# Altium schematic sheet 1_Main copy.schdoc
size 497 x 243 mm; Name: A_A4; Symbol: A_A4; Device: A_A4; @Project Name: TUD-EnergyHarvestingConsole_2022-08-29_17-01-09; REV: 1.0; Date: 2022-08-11; Sheet: 1/1; Draw By: Alejandro Cabrerizo; Convert to PCB: yes; Add into BOM: yes
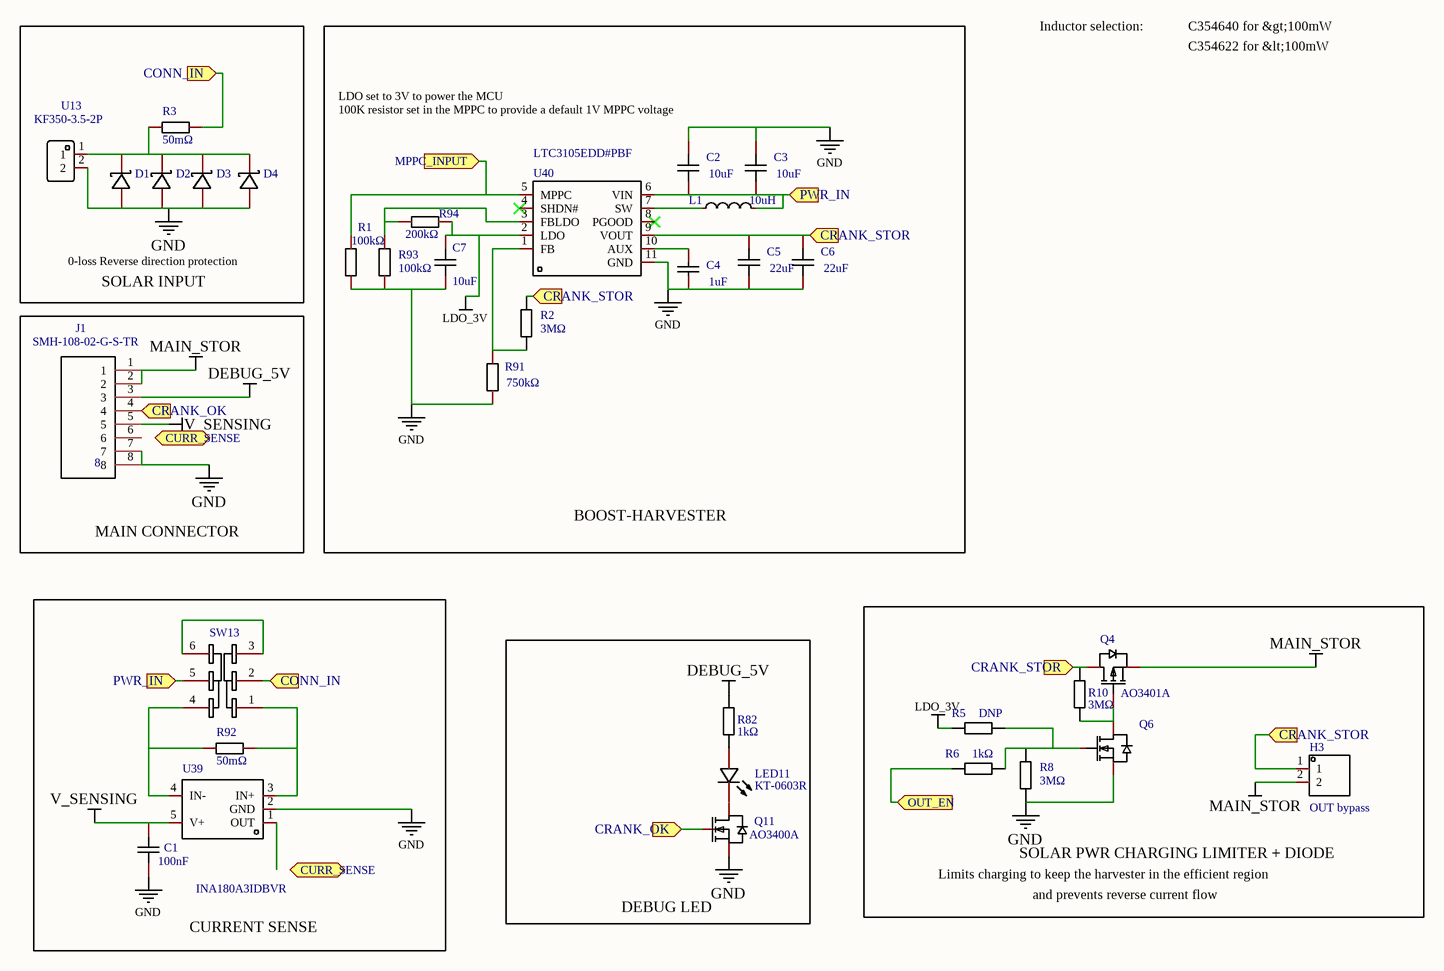
[diagram p0: 1_Main copy.schdoc]

## Parts
C1  100nF  [C0603]
C2  10uF  [C0603]
C3  10uF  [C0603]
C4  1uF  [C0603]
C5  22uF  [C0805]
C6  value 22uF  [C0805]  (hidden comment: CL21A226MAQNNNE_C45783)
C7  10uF  [C0603]
D1  SS54  [SMA_L4.4-W2.8-LS5.4-R-RD]  (value not drawn)
D2  SS54  [SMA_L4.4-W2.8-LS5.4-R-RD]  (value not drawn)
D3  SS54  [SMA_L4.4-W2.8-LS5.4-R-RD]  (value not drawn)
D4  SS54  [SMA_L4.4-W2.8-LS5.4-R-RD]  (value not drawn)
H3  OUT bypass  [HDR-TH_2P-P2.54-V-M-1]
J1  NAME: 8  [SMH-108-02-XX-S-TR]  (hidden comment: SMH-108-02-G-S-TR)
L1  value 10uH  [IND-SMD_L6.0-W6.0]  (hidden comment: CKCS6028-10uH/M)
LED11  KT-0603R  [LED0603-R-RD]
Q4  AO3401A  [SOT-23_L2.9-W1.3-P1.90-LS2.4-BR]
Q6  SI2302  [SOT-23-3_L2.9-W1.3-P1.90-LS2.4-BR]  (value not drawn)
Q11  AO3400A  [SOT-23-3_L2.9-W1.3-P1.90-LS2.4-BR]
R1  100kΩ  [R0603]
R2  3MΩ  [R0603]
R3  value 50mΩ  [R1206]  (hidden comment: 1206W3F500MT5E_C127691)
R5  DNP  [R0603]
R6  1kΩ  [R0603]
R8  3MΩ  [R0603]
R10  3MΩ  [R0603]
R82  1kΩ  [R0603]
R91  750kΩ  [R0603]
R92  value 50mΩ  [R1206]  (hidden comment: 1206W3F500MT5E_C127691)
R93  100kΩ  [R0603]
R94  value 200kΩ  [R0603]  (hidden comment: 0603WAF2003T5E)
SW13  K3-2235D-F1  [SW-TH_K3-2235D-F1]  (value not drawn)
U13  KF350-3.5-2P  [CONN-TH_P3.50_KF350-3.5-2P]
U39  INA180A3IDBVR  [SOT-23-5_L3.0-W1.7-P0.95-LS2.8-BR]
U40  LTC3105EDD#PBF  [DFN-10_L3.0-W3.0-P0.50-BL-EP_LTC3105EDD]

## Blocks framed on the sheet
SOLAR INPUT: D1-D4 R3 U13
BOOST-HARVESTER: C2-C7 L1 R1 R2 R91 R93 R94 U40
MAIN CONNECTOR: J1
CURRENT SENSE: C1 R92 SW13 U39
DEBUG LED: LED11 Q11 R82
SOLAR PWR CHARGING LIMITER + DIODE: H3 Q4 Q6 R5 R6 R8 R10

## Ports
CONN_IN (in), CRANK_OK (in), CRANK_STOR (in), CURR_SENSE (bidir), MPPC_INPUT (in), OUT_EN (in), PWR_IN (in)

## Nets
DEBUG_5V: J1.3 R82.2
GND: C1.1 C2.2 C3.2 C4.1 C5.1 C6.1 C7.1 D1.1(A) D2.1(A) D3.1(A) D4.1(A) J1.7 J1.8 Q6.2(S) Q11.2(S) R1.1 R8.2 R91.1 R93.1 U13.2 U39.2(GND) U40.11(GND)
LDO_3V: C7.2 R5.2 R94.2 U40.2(LDO)
MAIN_STOR: H3.2 J1.1 J1.2 Q4.2(S)
V_SENSING: C1.2 J1.5 U39.5(V+)
CONN_IN: R3.2 SW13.2 ; port CONN_IN
CRANK_OK: J1.4 Q11.1(G) ; port CRANK_OK
CRANK_STOR: C5.2 C6.2 H3.1 Q4.3(D) R2.1 R10.2 U40.9(VOUT) ; port CRANK_STOR
MPPC_INPUT: R1.2 U40.5(MPPC) ; port MPPC_INPUT
OUT_EN: R6.2 ; port OUT_EN
PWR_IN: C2.1 C3.1 L1.2 SW13.5 U40.6(VIN) ; port PWR_IN
NetC4_2: C4.2 U40.10(AUX)
NetD1_2: D1.2(K) D2.2(K) D3.2(K) D4.2(K) R3.1 U13.1
NetL1_1: L1.1 U40.7(SW)
NetLED11_1: LED11.1(A) R82.1
NetLED11_2: LED11.2(K) Q11.3(D)
NetQ4_1: Q4.1(G) Q6.3(D) R10.1
NetQ6_1: Q6.1(G) R5.1 R6.1 R8.1
NetR2_2: R2.2 R91.2 U40.1(FB)
NetR92_1: R92.1 SW13.4 U39.4(IN-)
NetR92_2: R92.2 SW13.1 U39.3(IN+)
NetR93_2: R93.2 R94.1 U40.3(FBLDO)
NetSW13_3: SW13.3 SW13.6

Not connected (* = marked no-connect by the designer): J1 6; U39 1(OUT); U40 4(SHDN#)* 8(PGOOD)*

## Notes on the sheet
- Inductor selection:
- C354622 for &lt;100mW
- C354640 for &gt;100mW
- (near R94) LDO set to 3V to power the MCU
  100K resistor set in the MPPC to provide a default 1V MPPC voltage
- 0-loss Reverse direction protection
- Limits charging to keep the harvester in the efficient region
- and prevents reverse current flow
- 1
- 2
- 3
- 4
- 5
- A
- B
- C
- D
- TITLE:
- TUD-EnergyHarvestingConsole_2022-08-29_17-01-09
- REV:
- 1.0
- Date:
- Company:
- 2022-08-11
- Drawn By:
- Alejandro Cabrerizo
- Sheet:
- 1/1

## Library data of the parts
C1 = CC0603KRX7R9BB104: Manufacturer: YAGEO; Convert to PCB: yes; NAME: 2; Name: 100nF; Symbol: 100nF; Device: CC0603KRX7R9BB104; Supplier: LCSC; Manufacturer Part: CC0603KRX7R9BB104; Supplier Part: C14663; JLCPCB Part Class: Basic; Add into BOM: yes; Origin Footprint: C0603; NUMBER: 2
C2 C3 C7 = CL10A106MA8NRNC: Capacitance: Tolerance:±20% Tolerance:±20% Voltage Rated: Temperature Coefficient:; Manufacturer: SAMSUNG(三星); Add into BOM: yes; Tolerance: ±20%; Name: 10uF; Symbol: CL10A106MA8NRNC; Device: CL10A106MA8NRNC; LCSC Part Name: 10uF ±20% 25V; Supplier Part: C96446; Manufacturer Part: CL10A106MA8NRNC; Supplier Footprint: 0603; JLCPCB Part Class: Basic Part; Datasheet: https://atta.szlcsc.com/upload/public/pdf/source/20170325/1490427913016.pdf; Supplier: LCSC; Convert to PCB: yes; Value: 10uF
C4 = CL10A105KB8NNNC: Capacitance: Tolerance:±10% Tolerance:±10% Voltage Rated: Temperature Coefficient:; Manufacturer: SAMSUNG(三星); Add into BOM: yes; Tolerance: ±10%; Name: 1uF; Symbol: CL10A105KB8NNNC; Device: CL10A105KB8NNNC; LCSC Part Name: 1uF ±10% 50V; Supplier Part: C15849; Manufacturer Part: CL10A105KB8NNNC; Supplier Footprint: 0603; JLCPCB Part Class: Basic Part; Datasheet: https://atta.szlcsc.com/upload/public/pdf/source/20160103/1457707679084.pdf; Supplier: LCSC; Convert to PCB: yes; Value: 1uF
C5 C6 = CL21A226MAQNNNE_C45783: Capacitance: Tolerance:±20% Tolerance:±20% Voltage Rated: Temperature Coefficient:; Manufacturer: SAMSUNG(三星); Add into BOM: yes; Tolerance: ±20%; Name: 22uF; Symbol: CL21A226MAQNNNE; Device: CL21A226MAQNNNE_C45783; LCSC Part Name: 22uF ±20% 25V; Supplier Part: C45783; Manufacturer Part: CL21A226MAQNNNE; Supplier Footprint: 0805; JLCPCB Part Class: Basic Part; Datasheet: https://atta.szlcsc.com/upload/public/pdf/source/20160103/1457707727161.pdf; Supplier: LCSC; Convert to PCB: yes
  C5: Value: 22uF
D1-D4 = SS54: Reverse Voltage (Vr):40V Average Rectified Current (Io):5A Forward Voltage (Vf@If):550mV@5A; Manufacturer: MDD; Symbol: SS54_C22452; Add into BOM: yes; Reverse Voltage (Vr): 40V; Average Rectified Current (Io): 5A; Device: SS54; LCSC Part Name: 40V 5A 550mV@5A; Supplier Part: C22452; Manufacturer Part: SS54; Supplier Footprint: SMA(DO-214AC); JLCPCB Part Class: Basic Part; Datasheet: https://atta.szlcsc.com/upload/public/pdf/source/20190306/C22452_DC5E4F74C3B638F6D8E4C7650D5BF30E.pdf; Supplier: LCSC; Convert to PCB: yes; Forward Voltage (Vf@If): 550mV@5A
H3 = HDR-M_2.54_1x2P: Symbol: 210S-1*2P L=11.6MMGold-plated black; Convert to PCB: yes; Name: OUT bypass; Device: HDR-M_2.54_1x2P; Add into BOM: yes; Supplier Footprint: Through
J1 = SMH-108-02-G-S-TR: Convert to PCB: yes; Name: SMH-108-02-G-S-TR; Symbol: SMH-108-02-G-S-TR; Device: SMH-108-02-G-S-TR; Add into BOM: yes; Origin Footprint: SMH-108-02-XX-S-TR
L1 = CKCS6028-10uH/M: Inductance: Tolerance: Tolerance: Rated Current: DC Resistance (DCR):; Manufacturer: CENKER(岑科); Add into BOM: yes; Name: 10uH; Symbol: CKCS6028-10UH/M; Device: CKCS6028-10uH/M; LCSC Part Name: 10uH ±20% 1.95A 72mΩ; Supplier Part: C354625; Manufacturer Part: CKCS6028-10uH/M; Supplier Footprint: SMD; JLCPCB Part Class: Extended Part; Datasheet: https://atta.szlcsc.com/upload/public/pdf/source/20190115/C354625_A8E6F49BBEB46DAB0D88928184334DFB.pdf; Supplier: LCSC; Convert to PCB: yes
LED11 = KT-0603R: Manufacturer: KENTO; Convert to PCB: yes; Name: KT-0603R; Symbol: KT-0603R; Device: KT-0603R; Supplier: LCSC; Manufacturer Part: KT-0603R; Supplier Part: C2286; JLCPCB Part Class: Basic Part; Add into BOM: yes; Origin Footprint: LED0603-R-RD
Q4 = AO3401A: Manufacturer: AOS; Convert to PCB: yes; Name: AO3401A; Symbol: AO3401A; Device: AO3401A; Supplier: LCSC; Manufacturer Part: AO3401A; Supplier Part: C15127; JLCPCB Part Class: Basic Part; Add into BOM: yes; Origin Footprint: SOT-23_L2.9-W1.3-P1.90-LS2.4-BR
Q6 = SI2302: Manufacturer: YONGYUTAI(永裕泰); Symbol: SI2302_C2891732; Add into BOM: yes; Device: SI2302; LCSC Part Name: SI2302; Supplier Part: C2891732; Manufacturer Part: SI2302; Supplier Footprint: SOT-23; JLCPCB Part Class: Extended Part; Datasheet: https://atta.szlcsc.com/upload/public/pdf/source/20210901/467BBA277A18343FF82D7D641AA41F7C.pdf; Supplier: LCSC; Convert to PCB: yes
Q11 = AO3400A: Manufacturer: HUASHUO(华朔); Convert to PCB: yes; Name: AO3400A; Symbol: AO3400A; Device: AO3400A; Supplier: LCSC; Supplier Part: C700953; Manufacturer Part: AO3400A; JLCPCB Part Class: Extended Part; Add into BOM: yes; Origin Footprint: SOT-23-3_L2.9-W1.3-P1.90-LS2.4-BR
R1 R93 = 0603WAF1003T5E: Type:Thick Film Resistors Resistance: Tolerance:±1% Tolerance:±1% Power(Watts): Temperature Coefficient:±100ppm/℃ Temperature Coefficient:±100ppm/℃ Overload Voltage (Max): Operating Temperature Range:-55℃~+155℃ Operating Temperature Range:-55℃~+155℃; Manufacturer: UNI-ROYAL(厚声); Add into BOM: yes; Tolerance: ±1%; Name: 100kΩ; Symbol: 0603WAF1003T5E; Device: 0603WAF1003T5E; LCSC Part Name: 100kΩ ±1% 100mW; Supplier Part: C25803; Manufacturer Part: 0603WAF1003T5E; Supplier Footprint: 0603; JLCPCB Part Class: Basic Part; Datasheet: https://atta.szlcsc.com/upload/public/pdf/source/20200306/C422600_1E6D84923E4A46A82E41ADD87F860B5C.pdf; Supplier: LCSC; Convert to PCB: yes; Type: Thick Film Resistors; Value: 100kΩ; Temperature Coefficient: ±100ppm/℃; Operating Temperature Range: -55℃~+155℃
R2 R8 R10 = 0603WAF3004T5E: Manufacturer: UniOhm; Resistance: 3M; Convert to PCB: yes; Name: 3MΩ; Symbol: 3MΩ; Device: 0603WAF3004T5E; Supplier: LCSC; Manufacturer Part: 0603WAF3004T5E; Supplier Part: C23156; JLCPCB Part Class: Basic Part; Add into BOM: yes; Origin Footprint: R0603
R3 R92 = 1206W3F500MT5E_C127691: Type:- Rated Current:- Rated Output Voltage:- Resistance: Tolerance:±1% Tolerance:±1% Power(Watts):- Temperature Coefficient:±800ppm/℃ Temperature Coefficient:±800ppm/℃ Mounting Sytle:; Manufacturer: UNI-ROYAL(厚声); Symbol: 1206W4F500MT5E; Add into BOM: yes; Tolerance: ±1%; Name: 50mΩ; Device: 1206W3F500MT5E_C127691; LCSC Part Name: 50mΩ ±1%; Supplier Part: C127691; Manufacturer Part: 1206W3F500MT5E; Supplier Footprint: 1206; JLCPCB Part Class: Extended Part; Datasheet: https://atta.szlcsc.com/upload/public/pdf/source/20170821/C127691_1503303435301901672.pdf; Supplier: LCSC; Convert to PCB: yes; Type: -; Rated Current: -; Rated Output Voltage: -; Power(Watts): -; Temperature Coefficient: ±800ppm/℃
R5 = 0603WAF1001T5E: Manufacturer: UniOhm; Symbol: 1kΩ; Resistance: 1K; Convert to PCB: yes; Name: DNP; Device: 0603WAF1001T5E; Supplier: LCSC; Manufacturer Part: 0603WAF1001T5E; Supplier Part: C21190; JLCPCB Part Class: Basic Part; Add into BOM: yes; Origin Footprint: R0603
R6 R82 = 0603WAF1001T5E: Manufacturer: UniOhm; Resistance: 1K; Convert to PCB: yes; Name: 1kΩ; Symbol: 1kΩ; Device: 0603WAF1001T5E; Supplier: LCSC; Manufacturer Part: 0603WAF1001T5E; Supplier Part: C21190; JLCPCB Part Class: Basic Part; Add into BOM: yes; Origin Footprint: R0603
R91 = 0603WAF7503T5E: Type:Thick Film Resistors Resistance: Tolerance:±1% Tolerance:±1% Power(Watts): Temperature Coefficient:±100ppm/℃ Temperature Coefficient:±100ppm/℃ Overload Voltage (Max): Operating Temperature Range:-55℃~+155℃ Operating Temperature Range:-55℃~+155℃; Manufacturer: UNI-ROYAL(厚声); Add into BOM: yes; Tolerance: ±1%; Name: 750kΩ; Symbol: 0603WAF7503T5E; Device: 0603WAF7503T5E; LCSC Part Name: 750kΩ ±1% 100mW; Supplier Part: C23240; Manufacturer Part: 0603WAF7503T5E; Supplier Footprint: 0603; JLCPCB Part Class: Basic Part; Datasheet: https://atta.szlcsc.com/upload/public/pdf/source/20200306/C422600_1E6D84923E4A46A82E41ADD87F860B5C.pdf; Supplier: LCSC; Convert to PCB: yes; Type: Thick Film Resistors; Value: 750kΩ; Temperature Coefficient: ±100ppm/℃; Operating Temperature Range: -55℃~+155℃
R94 = 0603WAF2003T5E: Resistance: Tolerance: Temperature Coefficient: Temperature Coefficient: Power(Watts): Overload Voltage (Max): Operating Temperature Range: Operating Temperature Range:; Manufacturer: UNI-ROYAL(厚声); Add into BOM: yes; Name: 200kΩ; Symbol: 0603WAF2003T5E; Device: 0603WAF2003T5E; LCSC Part Name: 200KΩ ±1%; Supplier Part: C25811; Manufacturer Part: 0603WAF2003T5E; Supplier Footprint: 0603; JLCPCB Part Class: Basic Part; Datasheet: https://atta.szlcsc.com/upload/public/pdf/source/20170920/C25811_1505901554531983383.pdf; Supplier: LCSC; Convert to PCB: yes
SW13 = K3-2235D-F1: Current Rating (DC):300mA Voltage Rating (DC):6V Current Rating (AC):- Voltage Rating (AC):- Circuit:双刀双掷 Mounting Style:直插 Mechanical Life:10000 Actuator Color:黑色 Actuator Style:矩形柱状 Pin Style:PC引脚 Operating Temperature:-25~+80 Operating Temperature:-2; Manufacturer: 韩国韩荣; Add into BOM: yes; Current Rating (DC): 300mA; Voltage Rating (DC): 6V; Circuit: 双刀双掷; Mechanical Life: 10000; Actuator Color: 黑色; Actuator Style: 矩形柱状; Pin Style: PC引脚; Switch Length: 9mm; Switch Width: 3.5mm; Symbol: K3-2235D-F1; Device: K3-2235D-F1; LCSC Part Name: K3-2235D-F1; Supplier Part: C189615; Manufacturer Part: K3-2235D-F1; Supplier Footprint: 插件; JLCPCB Part Class: Extended Part; Datasheet: https://atta.szlcsc.com/upload/public/pdf/source/20210810/9F56F04DF7CBA8FC4D1B091DF1444945.pdf; Supplier: LCSC; Convert to PCB: yes; Current Rating (AC): -; Voltage Rating (AC): -; Mounting Style: 直插; Operating Temperature: -25~+80; Switch Height: 3.5mm
U13 = KF350-3.5-2P: Manufacturer: Cixi Kefa Elec; Convert to PCB: yes; Name: KF350-3.5-2P; Symbol: KF350-3.5-2P; Device: KF350-3.5-2P; Supplier: LCSC; Supplier Part: C474892; Manufacturer Part: KF350-3.5-2P; JLCPCB Part Class: Extended Part; Add into BOM: yes; Origin Footprint: CONN-TH_P3.50_KF350-3.5-2P
U39 = INA180A3IDBVR: Manufacturer: TI(德州仪器); Add into BOM: yes; Symbol: INA180A3IDBVR; Device: INA180A3IDBVR; LCSC Part Name: INA180A3IDBVR; Supplier Part: C122882; Manufacturer Part: INA180A3IDBVR; Supplier Footprint: SOT-23-5; JLCPCB Part Class: Extended Part; Datasheet: https://atta.szlcsc.com/upload/public/pdf/source/20171014/C122882_15079752744071037935.pdf; Supplier: LCSC; Convert to PCB: yes
U40 = LTC3105EDD#PBF: Number of Outputs:1 Output Voltage:1.5V~5.25V Output Voltage:1.5V~5.25V Operating Temperature:-40℃~+85℃ Operating Temperature:-40℃~+85℃; Manufacturer: ADI(亚德诺)/LINEAR(凌特); Add into BOM: yes; Number of Outputs: 1; Name: LTC3105EDD#PBF; Symbol: LTC3105EDD#PBF; Device: LTC3105EDD#PBF; LCSC Part Name: Vout=1.5V~5.25V; Supplier Part: C684028; Manufacturer Part: LTC3105EDD#PBF; Supplier Footprint: DFN-10-EP(3x3); JLCPCB Part Class: Extended Part; Datasheet: https://atta.szlcsc.com/upload/public/pdf/source/20170413/1492062817410.pdf; Supplier: LCSC; Convert to PCB: yes; Output Voltage: 1.5V~5.25V; Operating Temperature: -40℃~+85℃